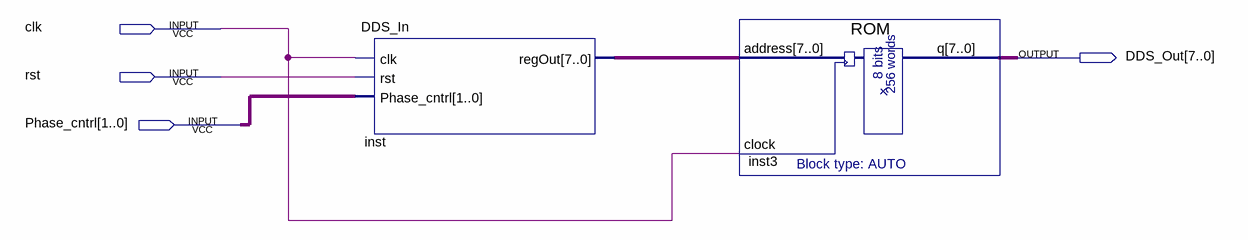
[diagram p0: schematic sheet]
// Quartus schematic DDS.bdf as structural Verilog: 2 symbols, 4 pins
module DDS (
  input  clk,
  input  rst,
  input  [1:0] Phase_cntrl,
  output [7:0] DDS_Out
);

  wire [7:0] inst_regout;

  DDS_In inst (.clk(clk), .rst(rst), .Phase_cntrl(Phase_cntrl), .regOut(inst_regout));
  ROM inst3 (.address(inst_regout), .clock(clk), .q(DDS_Out));
endmodule
